# Altium schematic sheet sensors.SchDoc
size A4
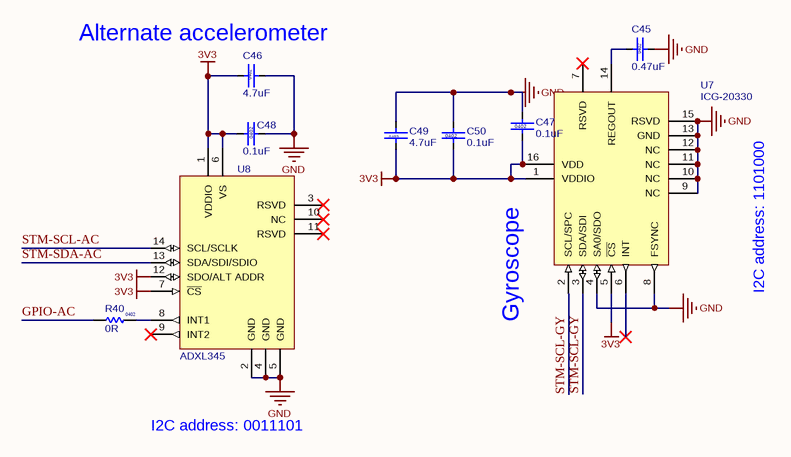
[diagram p0: sensors.SchDoc]

## Parts
C45  value 0.47uF  Size: 0402  [Cap 0402 HD]
C46  value 4.7uF  Size: 0402  [Cap 0402 HD]
C47  value 0.1uF  Size: 0402  [Cap 0402 HD]  (hidden comment: 120-000160.1uF)
C48  value 0.1uF  Size: 0402  [Cap 0402 HD]  (hidden comment: 120-000160.1uF)
C49  value 4.7uF  Size: 0402  [Cap 0402 HD]
C50  value 0.1uF  Size: 0402  [Cap 0402 HD]  (hidden comment: 120-000160.1uF)
R40  value 0R  Size: 0402  [RES 0402 HD]
U7  (no value)  [ICG-20330]
U8  (no value)  [ADXL345]

## Nets
3V3: C46.1 C47.1 C48.1 C49.1 C50.1 U7.1(VDDIO) U7.5(~{CS}) U7.16(VDD) U8.1(VDDIO) U8.6(VS) U8.7(~{CS}) U8.12(SDO/ALT_ADDR)
GND: C45.2 C46.2 C47.2 C48.2 C49.2 C50.2 U7.4(SA0/SDO) U7.8(FSYNC) U7.9(NC) U7.10(NC) U7.11(NC) U7.12(NC) U7.13(GND) U7.15(RSVD) U8.2(GND) U8.4(GND) U8.5(GND)
GPIO-AC: R40.1
STM-SCL-AC: U8.14(SCL/SCLK)
STM-SCL-GY: U7.2(SCL/SPC) U7.3(SDA/SDI)
STM-SDA-AC: U8.13(SDA/SDI/SDIO)
NetC45_1: C45.1 U7.14(REGOUT)
NetR40_2: R40.2 U8.8(INT1)

Not connected (* = marked no-connect by the designer): U7 6(INT)* 7(RSVD)*; U8 3(RSVD)* 9(INT2)* 10(NC)* 11(RSVD)*

## Notes on the sheet
- (near C46) Alternate accelerometer
- (near U7) Gyroscope
- I2C address: 1101000
- I2C address: 0011101

## Library data of the parts
C45 = 120-00072: Cap, Ceramic, 0.47UF 10V 10% X5R 0402; Manufacturer 1: Murata Electronics North America; Manufacturer Part Number 1: GRM155R61A474KE15J; Part Name: CAP CER 0.47UF 10V 10% X5R 0402; Item Phase: In Production; Tolerance: +/- 10%; Use in new designs: Yes; UBX Code: None; Part Number: 120-00072; Supplier 1: Digi-Key; Supplier Part Number 1: 490-6305-1-ND; Manufacturer 2: Samsung Electro-Mechanics America, Inc; Manufacturer Part Number 2: CL05A474KP5NNNC; Supplier 2: Digi-Key; Supplier Part Number 2: 1276-1173-1-ND; Height: 0.55mm; Max Operating Temp: 85; Min Operating Temp: -55; Pins: 2; Revision: 0A; Temperature Coefficient: X5R; Voltage: 10V
C46 C49 = 120-00020: Cap, Ceramic 4.7uF 10V 20% X5R 0402; Manufacturer 1: Samsung Electro-Mechanics America, Inc; Manufacturer Part Number 1: CL05A475MP5NRNC; Part Name: CAP CER 4.7uF 10V 20% X5R 0402; Item Phase: In Production; Tolerance: +/- 20%; Use in new designs: Yes; UBX Code: None; Part Number: 120-00020; Supplier 1: Digi-Key; Supplier Part Number 1: 1276-1482-1-ND; Manufacturer 2: Yageo; Manufacturer Part Number 2: CC0402KRX5R6BB475; Supplier 2: Digi-Key; Supplier Part Number 2: 311-3477-1-ND; Height: 0.55mm; Max Operating Temp: 85; Min Operating Temp: -55; Pins: 2; Revision: 0C; Temperature Coefficient: X5R; Voltage: 10V
C47 C48 C50 = 120-00016: Cap, Ceramic 0.1uF 10V 10% X5R 0402; Part Name: CAP CER 0.1UF 10V 10% X5R 0402; Part_Type: Ceramic Capacitor; Manufacturer: Murata Electronics North America; Manufacturer P/N: GRM155R61A104KA01J; Item_Phase: Production; Component Mounting Type: SMT; Tolerance: +/- 10%; Use in new designs: Yes; Part Number: 120-00016; Revision: 0A; Supplier 1: Digi-Key; Supplier Part Number 1: 490-6297-1-ND; Manufacturer 2: Yageo; Manufacturer P/N 2: CC0402KRX5R6BB104; Supplier 2: Digi-Key; Supplier Part Number 2: 311-1336-1-ND; Arena Link: https://app.bom.com/a/GYHPV2L2L43KRMBK?v=spec.summary; Height: 0.55mm; Pins: 2; Temperature Coefficient: X5R; Voltage: 10V
R40 = 180-00020: Resistor 0 ohm 1/16W 0402; Manufacturer 1: Yageo; Manufacturer Part Number 1: RC0402FR-070RL; Part Name: RES SMD 0.0 OHM JUMPER 1/16W 0402; Item Phase: In Production; Tolerance: None; Use in new designs: Yes; Part Number: 180-00020; Supplier 1: Digi-Key; Supplier Part Number 1: 311-0.0LRCT-ND; Manufacturer 2: Hong Kong Resistors Manufactory; Manufacturer Part Number 2: RCT020RLF; Supplier 2: None; Supplier Part Number 2: None; Height: 0.40mm; Max Operating Temp: 155; Min Operating Temp: -55; Pins: 2; Power: 1/16W; Revision: 0E; Voltage: N/A; UBX Code: None
U7 = ICG-20330: SENSOR, Gyroscope, I2C, 3-AXIS, 1.7-3.45V, SMT, LGA-16, 3mmX3mm; Manufacturer 1: TDK InvenSense; Part Name: LIS3MDL; Body Size: 2mm x 2mm; Current: None; Item Phase: In Production; MFG Package: LGA-12; Use in new designs: Yes; Voltage: 1.9-3.6V; Part Number: ICG-20330; Manufacturer Part Number 1: ICG-20330; Height: 1mm; Max Operating Temp: 85; Min Operating Temp: -40; Pins: 12; Revision: 0A; UBX Code: None
U8 = ADXL345: SENSOR, ACCELEROMETER, 3-AXIS, I2C, SMT, +/-16g, LGA-14 3mmX5mm; Manufacturer 1: Analog Devices; Part Name: B39162B4353P810; Body Size: 1.4mm x 1.1mm; Current: None; Item Phase: In Production; MFG Package: QCS5P; Use in new designs: Yes; Part Number: ADXL345; Manufacturer Part Number 1: ADXL345; Height: 0.45mm; Max Operating Temp: 85; Min Operating Temp: -40; Pins: 5; Revision: 0A; Voltage: N/A; UBX Code: None